# EAGLE schematic CAN_FB_V02 (EAGLE 9.3.2)
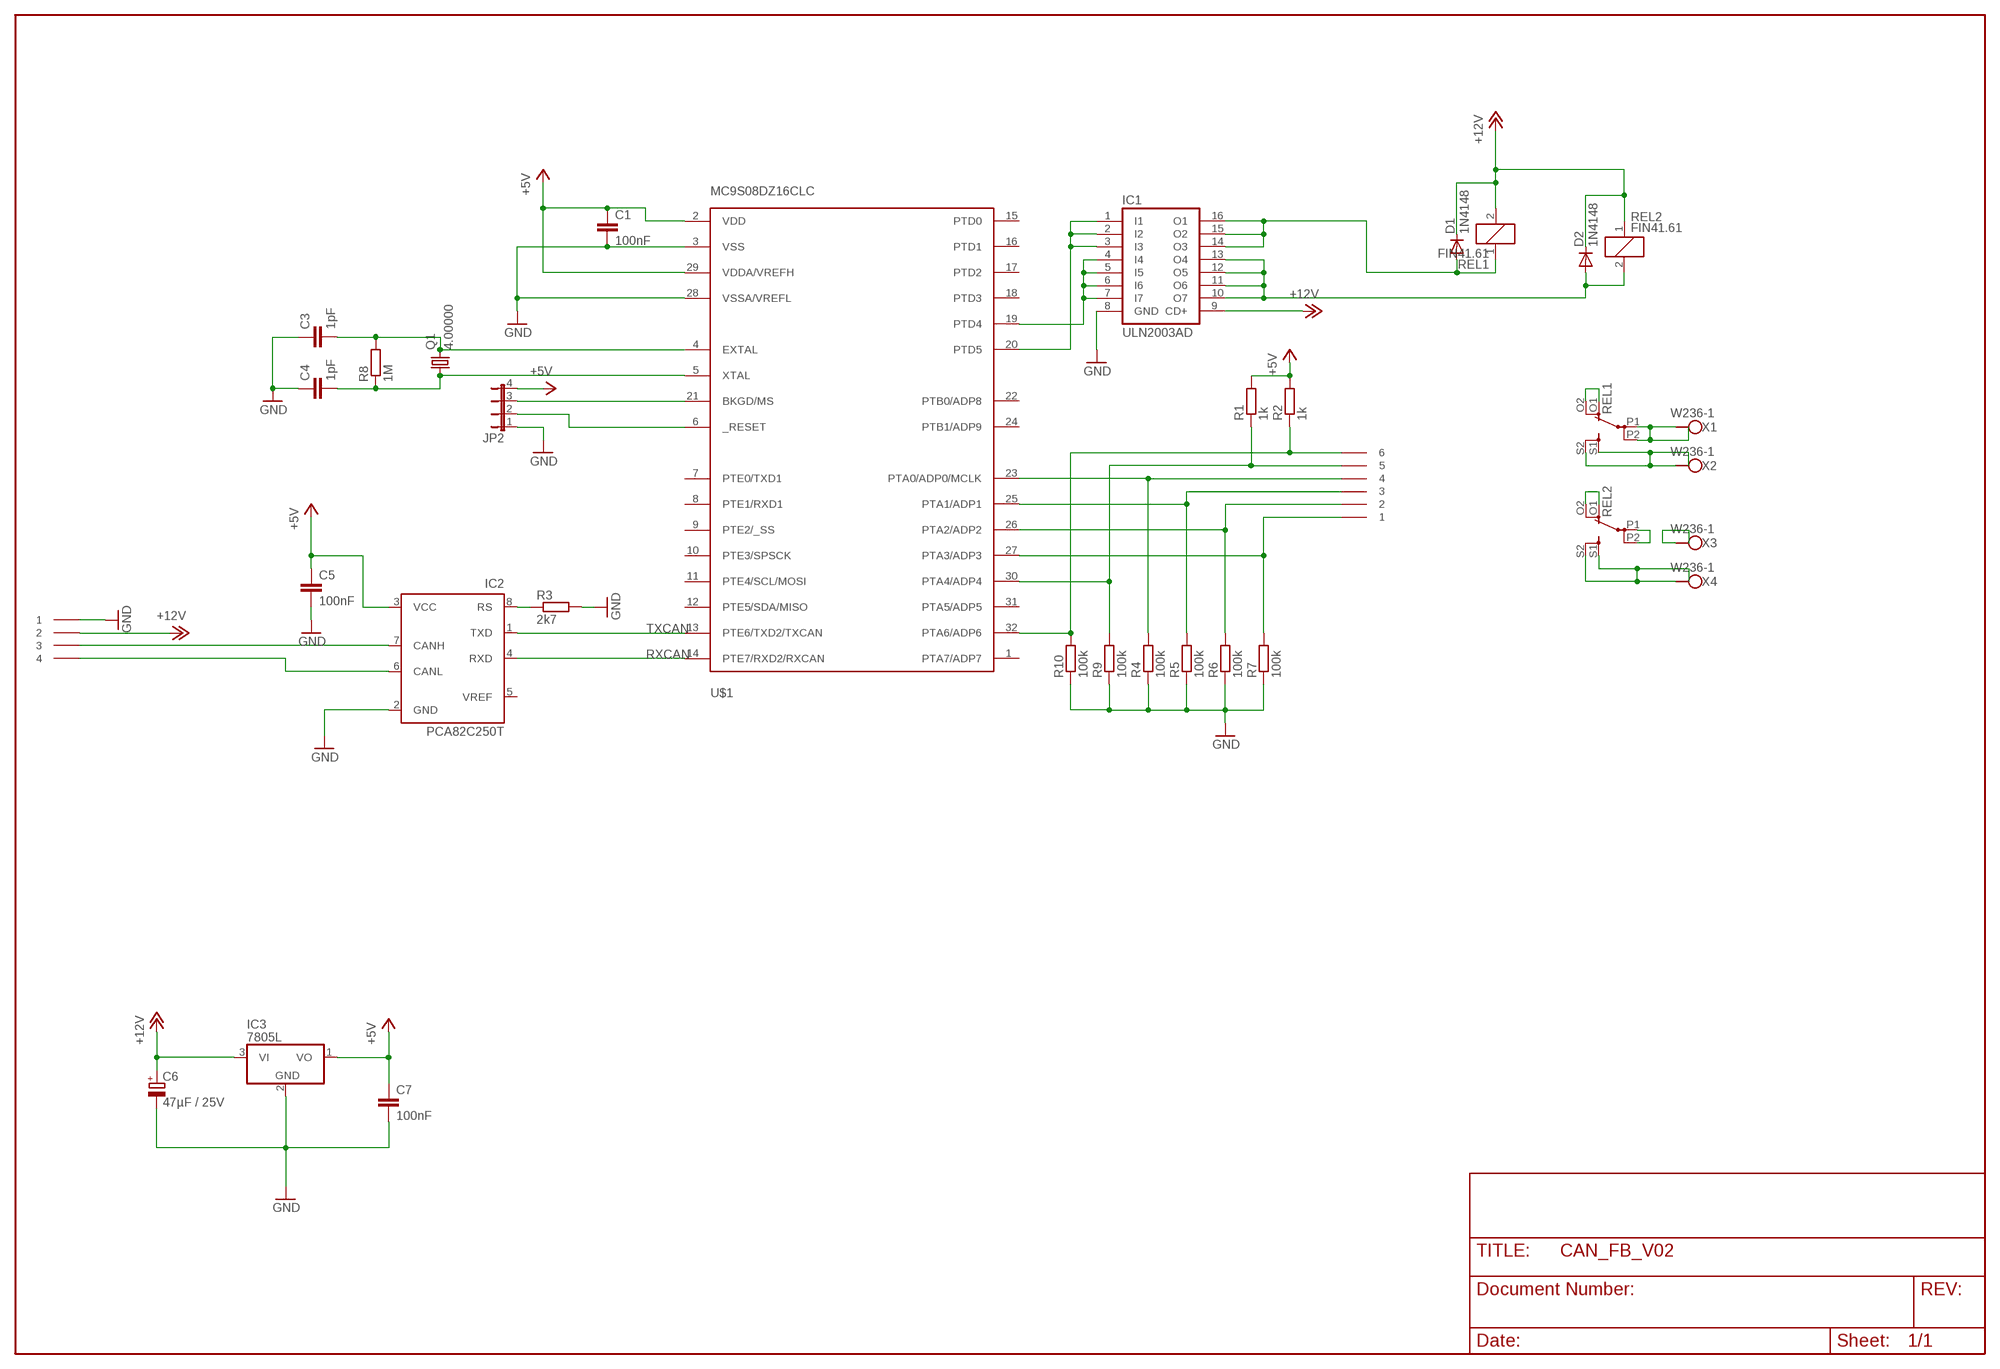
[diagram p0: schematic, sheet 1]

## Parts
C1  100nF  C-EUC0805K  [C0805K]
C3  1pF  C-EUC0805K  [C0805K]
C4  1pF  C-EUC0805K  [C0805K]
C5  100nF  C-EUC0805  [C0805]
C6  47µF / 25V  CPOL-EUE2-5  [E2-5]
C7  100nF  C-EUC0805K  [C0805K]
D1  1N4148  DIODE-SOD80C  [SOD80C]
D2  1N4148  DIODE-SOD80C  [SOD80C]
IC1  ULN2003AD  [SO16]
IC2  PCA82C250T  [SO8]
IC3  7805L  [TO92]
JP2  JP4E  [JP4]
KL1  AST021-04  [AST021-04]
KL2  AST021-06  [AST021-06]
Q1  4.00000  CRYTALHC49U-V  [HC49U-V]
R1  1k  R-EU_R0805  [R0805]
R2  1k  R-EU_R0805  [R0805]
R3  2k7  R-EU_R0805  [R0805]
R4  100k  R-EU_R0805  [R0805]
R5  100k  R-EU_R0805  [R0805]
R6  100k  R-EU_R0805  [R0805]
R7  100k  R-EU_R0805  [R0805]
R8  1M  R-EU_R0805  [R0805]
R9  100k  R-EU_R0805  [R0805]
R10  100k  R-EU_R0805  [R0805]
REL1  FIN41.61  [FIN41]
REL2  FIN41.61  [FIN41]
U$1  MC9S08DZ16CLC  [LQFP32]
X1  W236-1  [W236-1]
X2  W236-1  [W236-1]
X3  W236-1  [W236-1]
X4  W236-1  [W236-1]

## Nets
+5V: C1.1 C5.1 C7.1 IC2.3(VCC) IC3.1(VO) JP2.4 R1.2 R2.2 U$1.2(VDD) U$1.29(VDDA/VREFH)
+12V: C6.+ D1.C D2.C IC1.9(CD+) IC3.3(VI) KL1.P$2 REL1.2 REL2.1
A0: KL2.P$4 R4.2 U$1.23(PTA0/ADP0/MCLK)
A1: KL2.P$3 R5.2 U$1.25(PTA1/ADP1)
A2: KL2.P$2 R6.2 U$1.26(PTA2/ADP2)
A3: KL2.P$1 R7.2 U$1.27(PTA3/ADP3)
A4: KL2.P$5 R1.1 R9.2 U$1.30(PTA4/ADP4)
A5: KL2.P$6 R2.1 R10.2 U$1.32(PTA6/ADP6)
GND: C1.2 C3.1 C4.1 C5.2 C6.- C7.2 IC1.8(GND) IC2.2(GND) IC3.2(GND) JP2.1 KL1.P$1 R3.2 R4.1 R5.1 R6.1 R7.1 R9.1 R10.1 U$1.3(VSS) U$1.28(VSSA/VREFL)
N$3: IC2.8(RS) R3.1
N$4: IC2.6(CANL) KL1.P$4
N$6: D1.A IC1.14(O3) IC1.15(O2) IC1.16(O1) REL1.1
N$7: IC2.7(CANH) KL1.P$3
N$8: D2.A IC1.10(O7) IC1.11(O6) IC1.12(O5) IC1.13(O4) REL2.2
N$9: C4.2 Q1.1 R8.1 U$1.5(XTAL)
N$10: C3.2 Q1.2 R8.2 U$1.4(EXTAL)
N$11: IC1.1(I1) IC1.2(I2) IC1.3(I3) U$1.20(PTD5)
N$12: IC1.4(I4) IC1.5(I5) IC1.6(I6) IC1.7(I7) U$1.19(PTD4)
N$16: REL1.S1(S) REL1.S2(S) X2.1(KL1) X2.2(KL2)
N$18: REL1.P1(P) REL1.P2(P) X1.1(KL1) X1.2(KL2)
N$20: REL1.O1(O) REL1.O2(O)
N$21: JP2.2 U$1.6(_RESET)
N$22: JP2.3 U$1.21(BKGD/MS)
N$23: REL2.O1(O) REL2.O2(O)
N$25: X3.1(KL1) X3.2(KL2)
N$26: REL2.S1(S) REL2.S2(S) X4.1(KL1) X4.2(KL2)
N$27: REL2.P1(P) REL2.P2(P)
RXCAN: IC2.4(RXD) U$1.14(PTE7/RXD2/RXCAN)
TXCAN: IC2.1(TXD) U$1.13(PTE6/TXD2/TXCAN)
Unconnected: IC2.5(VREF) U$1.1(PTA7/ADP7) U$1.7(PTE0/TXD1) U$1.8(PTE1/RXD1) U$1.9(PTE2/_SS) U$1.10(PTE3/SPSCK) U$1.11(PTE4/SCL/MOSI) U$1.12(PTE5/SDA/MISO) U$1.15(PTD0) U$1.16(PTD1) U$1.17(PTD2) U$1.18(PTD3) U$1.22(PTB0/ADP8) U$1.24(PTB1/ADP9) U$1.31(PTA5/ADP5)

## Library data of the parts
C1 C3-C5 C7 = rcl:C-EU: CAPACITOR, European symbol
C6 = rcl:CPOL-EU: POLARIZED CAPACITOR, European symbol
D1 D2 = diode:DIODE-: DIODE
IC1 = uln-udn:ULN2003A: DRIVER ARRAY
IC2 = micro-philips:PCA82C250: CAN CONTROLLER INTERFACE
IC3 = linear:78*: Positive VOLTAGE REGULATOR
JP2 = jumper:JP4E: JUMPER
KL1 = con-ria:AST021-04
KL2 = con-ria:AST021-06
Q1 = crystal:CRYTAL: CRYSTAL
R1-R10 = rcl:R-EU_: RESISTOR, European symbol
REL1 REL2 = relay:FIN41.61
U$1 = MC9S08DZ16CLC:MC9S08DZ16CLC
X1-X4 = con-wago-508:W236-1: WAGO SREW CLAMP